# Altium schematic sheet Sheet3.SchDoc
size A4
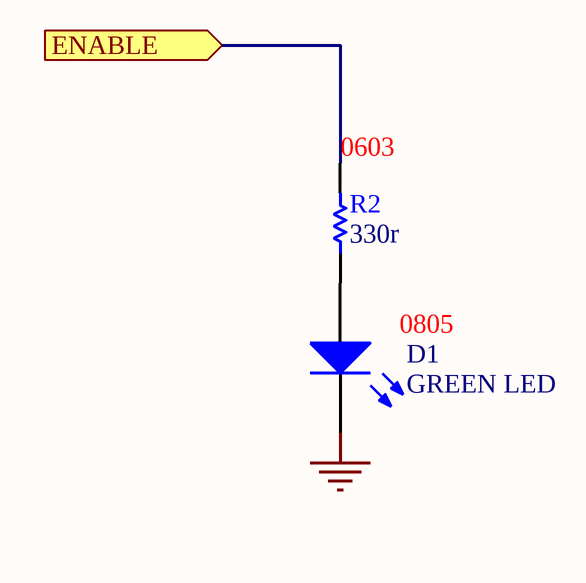
[diagram p0: Sheet3.SchDoc]

## Parts
D1  GREEN LED  [3.2X1.6X1.1]
R2  330r  [AXIAL-0.3]

## Ports
ENABLE (in)

## Nets
GND: D1.2(K)
ENABLE: R2.2 ; port ENABLE
NetD1_1: D1.1(A) R2.1

## Notes on the sheet
- (near R2) 0603
- 0805

## Library data of the parts
D1 = LED2: Typical RED, GREEN, YELLOW, AMBER GaAs LED; Published: 8-Jun-2000; LatestRevisionDate: 17-Jul-2002; LatestRevisionNote: Re-released for DXP Platform.; PackageVersion: Feb-2002; PackageReference: 3.2X1.6X1.1; Publisher: Altium Limited; PackageDescription: SM LED; 2 Flat Leads
R2 = Res1: Resistor; Value: 330; Published: 8-Jun-2000; LatestRevisionDate: 17-Jul-2002; LatestRevisionNote: Re-released for DXP Platform.; PackageReference: AXIAL-0.3; Publisher: Altium Limited; PackageDescription: Axial Device, Thru-Hole; 2 Leads; 0.3 in Pin Spacing